# EAGLE design PCB-GONIO-V2 (EAGLE 9.6.2)
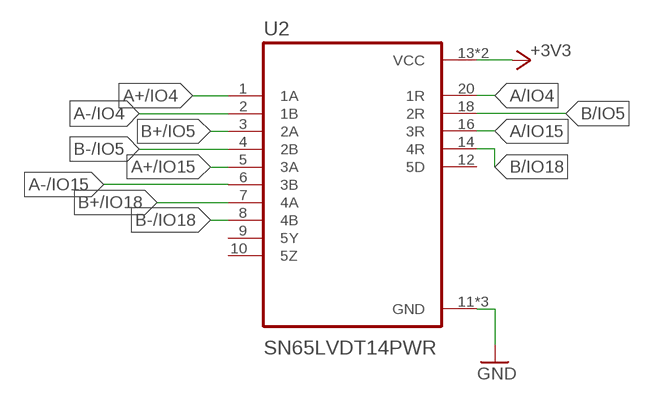
[diagram p0: schematic, sheet 1, part 1 of 2]
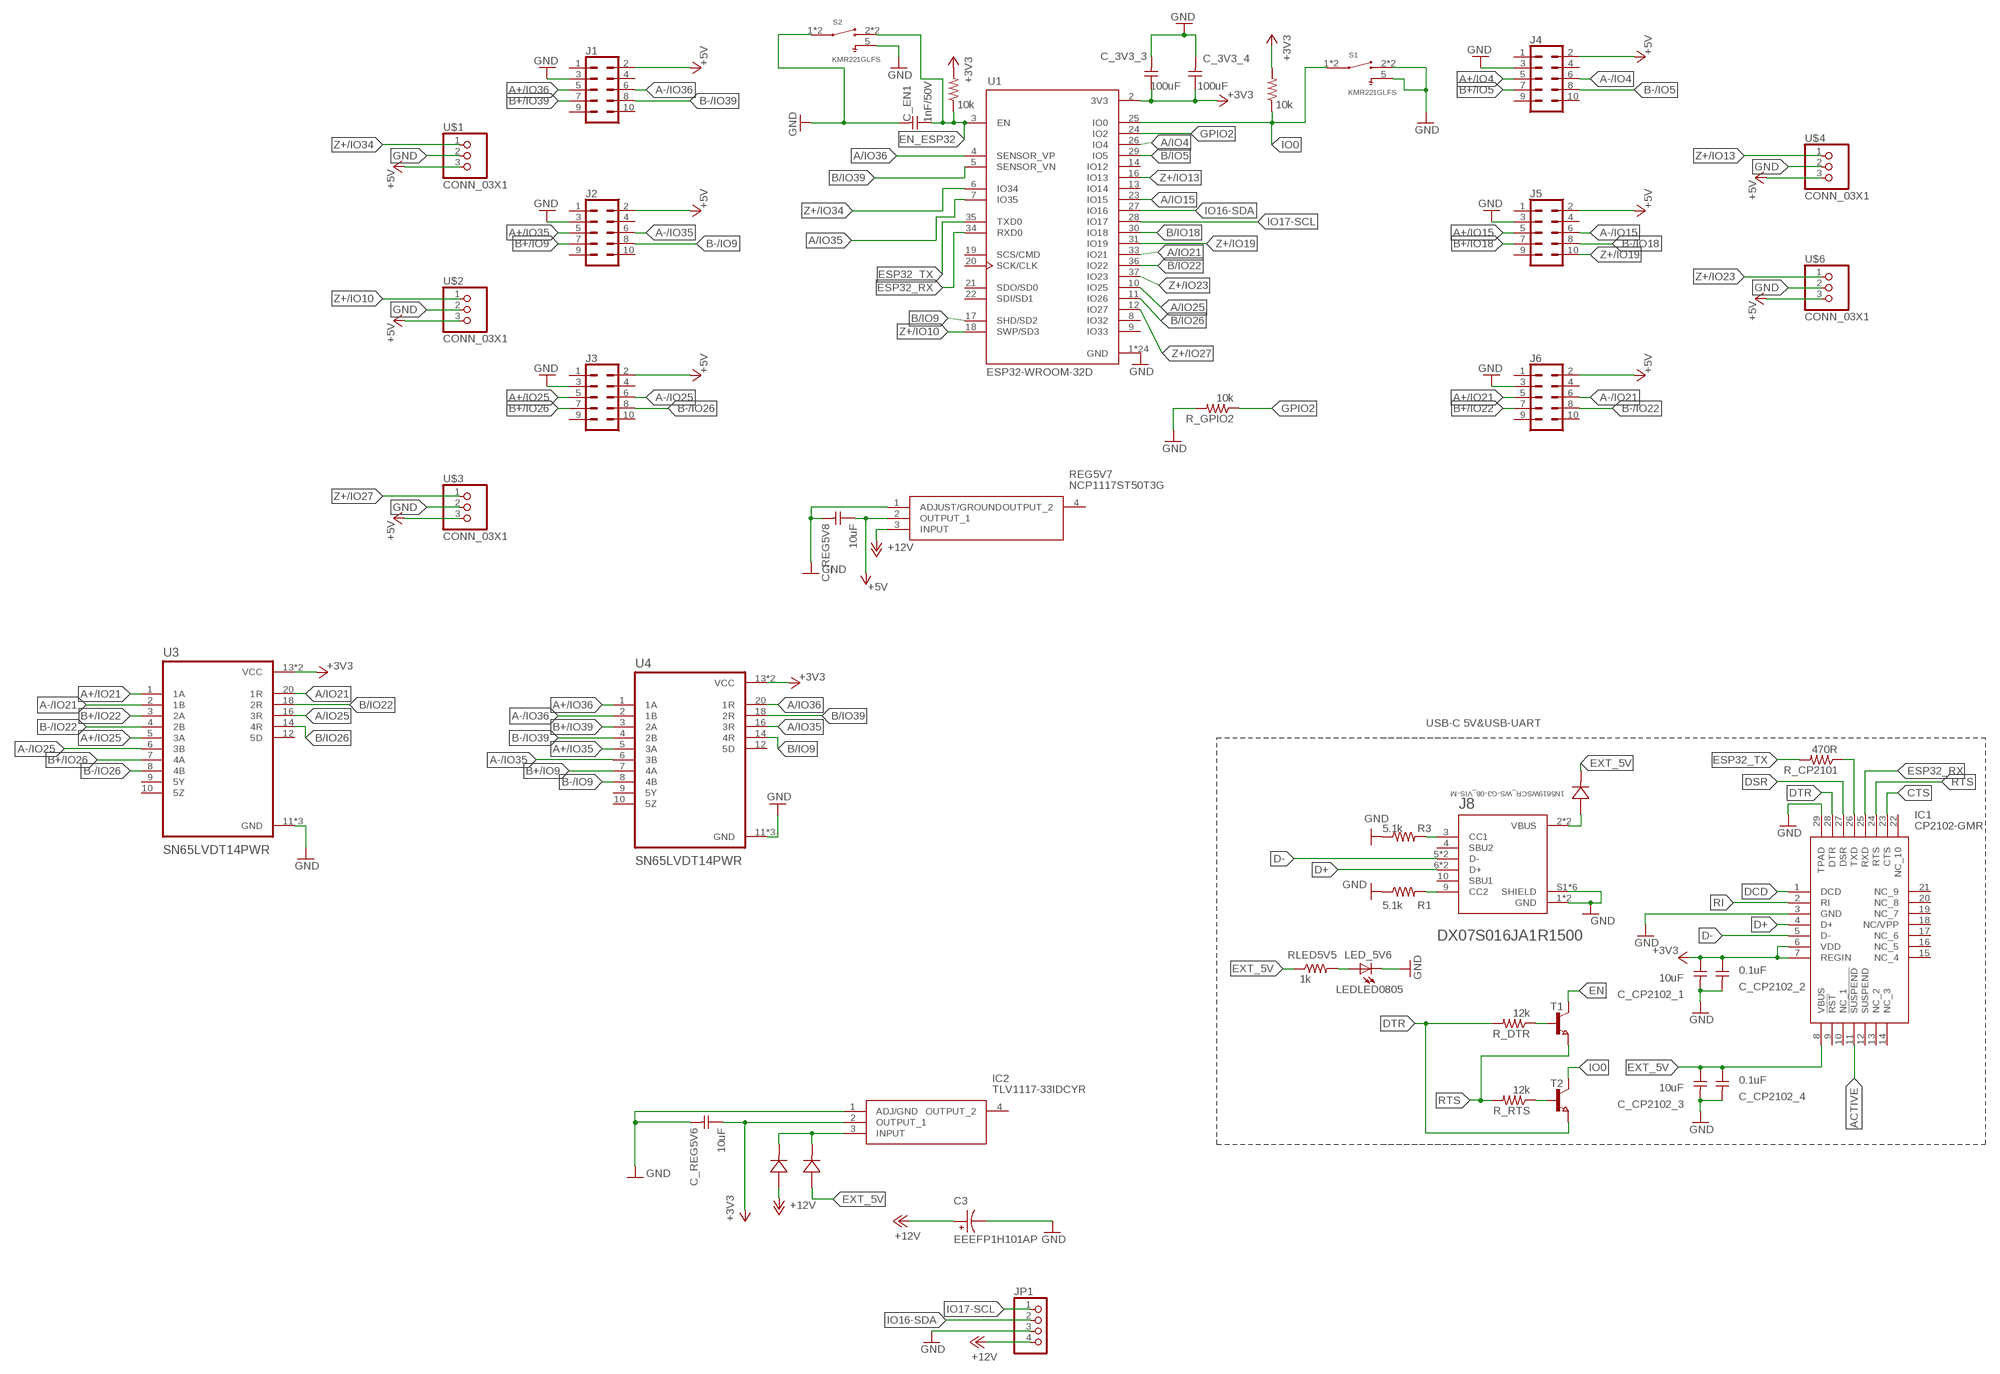
[diagram p1: schematic, sheet 1, part 2 of 2]

## Parts
C3  EEEFP1H101AP  [CAP_EEEFP1H101AP]
C_3V3_3  100uF  CAP_UNPOLARIZEDFAB  [C1206FAB]
C_3V3_4  100uF  CAP_UNPOLARIZEDFAB  [C1206FAB]
C_CP2102_1  10uF  CAP_UNPOLARIZEDFAB  [C1206FAB]
C_CP2102_2  0.1uF  CAP_UNPOLARIZEDFAB  [C1206FAB]
C_CP2102_3  10uF  CAP_UNPOLARIZEDFAB  [C1206FAB]
C_CP2102_4  0.1uF  CAP_UNPOLARIZEDFAB  [C1206FAB]
C_EN1  1nF/50V  CAP_UNPOLARIZEDFAB  [C1206FAB]
C_REG5V6  10uF  CAP_UNPOLARIZEDFAB  [C1206FAB]
C_REG5V8  10uF  CAP_UNPOLARIZEDFAB  [C1206FAB]
CR1  1N5819WSCR_WS-G3-08_VIS-M  [CR_WS-G3-08_VIS-M]
CR2  1N5819WSCR_WS-G3-08_VIS-M  [CR_WS-G3-08_VIS-M]
CR3  1N5819WSCR_WS-G3-08_VIS-M  [CR_WS-G3-08_VIS-M]
IC1  CP2102-GMR  [QFN50P500X500X100-29N]
IC2  TLV1117-33IDCYR  [SOT230P700X180-4N]
J1  CONN_05X2SHD  [2X5-SHROUDED]
J2  CONN_05X2SHD  [2X5-SHROUDED]
J3  CONN_05X2SHD  [2X5-SHROUDED]
J4  CONN_05X2SHD  [2X5-SHROUDED]
J5  CONN_05X2SHD  [2X5-SHROUDED]
J6  CONN_05X2SHD  [2X5-SHROUDED]
J8  DX07S016JA1R1500  [JAE_DX07S016JA1R1500]
JP1  PINHD-1X4  [1X04]
LED_5V6  LEDLED0805  [LEDC2012X90N]
R1  5.1k  R-US_R1206W  [R1206W]
R3  5.1k  R-US_R1206W  [R1206W]
R_CP2101  470R  R1206FAB  [R1206FAB]
R_DTR  12k  R1206FAB  [R1206FAB]
R_GPIO2  10k  R1206FAB  [R1206FAB]
R_PULL_UP1  10k  R1206FAB  [R1206FAB]
R_PULL_UP3  10k  R1206FAB  [R1206FAB]
R_RTS  12k  R1206FAB  [R1206FAB]
REG5V7  NCP1117ST50T3G  [SOT230P700X180-4N]
RLED5V5  1k  R1206FAB  [R1206FAB]
S1  KMR221GLFS  [SW_KMR221GLFS]
S2  KMR221GLFS  [SW_KMR221GLFS]
T1  T_NPN_S8050-J3Y_CHANGJ_SOT23-BEC  [SOT23]
T2  T_NPN_S8050-J3Y_CHANGJ_SOT23-BEC  [SOT23]
U1  ESP32-WROOM-32D  [MODULE_ESP32-WROOM-32D]
U2  SN65LVDT14PWR  [SOP65P640X120-20N]
U3  SN65LVDT14PWR  [SOP65P640X120-20N]
U4  SN65LVDT14PWR  [SOP65P640X120-20N]
U$1  CONN_03X1  [1X3]
U$2  CONN_03X1  [1X3]
U$3  CONN_03X1  [1X3]
U$4  CONN_03X1  [1X3]
U$6  CONN_03X1  [1X3]

## Nets
+3V3: C_3V3_3.1 C_3V3_4.1 C_CP2102_1.1 C_CP2102_2.1 C_REG5V6.1 IC1.6(VDD) IC1.7(REGIN) IC2.2(OUTPUT_1) R_PULL_UP1.2 R_PULL_UP3.2 U1.2(3V3) U2.13(VCC) U2.17(VCC) U3.13(VCC) U3.17(VCC) U4.13(VCC) U4.17(VCC)
+5V: C_REG5V8.1 J1.2 J2.2 J3.2 J4.2 J5.2 J6.2 REG5V7.2(OUTPUT_1) U$1.3 U$2.3 U$3.3 U$4.3 U$6.3
+12V: C3.1 CR2.2 JP1.4 REG5V7.3(INPUT)
A+/IO4: J4.5 U2.1(1A)
A+/IO15: J5.5 U2.5(3A)
A+/IO21: J6.5 U3.1(1A)
A+/IO25: J3.5 U3.5(3A)
A+/IO35: J2.5 U4.5(3A)
A+/IO36: J1.5 U4.1(1A)
A-/IO4: J4.6 U2.2(1B)
A-/IO15: J5.6 U2.6(3B)
A-/IO21: J6.6 U3.2(1B)
A-/IO25: J3.6 U3.6(3B)
A-/IO35: J2.6 U4.6(3B)
A-/IO36: J1.6 U4.2(1B)
A/IO4: U1.26(IO4) U2.20(1R)
A/IO15: U1.23(IO15) U2.16(3R)
A/IO21: U1.33(IO21) U3.20(1R)
A/IO25: U1.10(IO25) U3.16(3R)
A/IO35: U1.7(IO35) U4.16(3R)
A/IO36: U1.4(SENSOR_VP) U4.20(1R)
ACTIVE: IC1.11(!SUSPEND)
B+/IO5: J4.7 U2.3(2A)
B+/IO9: J2.7 U4.7(4A)
B+/IO18: J5.7 U2.7(4A)
B+/IO22: J6.7 U3.3(2A)
B+/IO26: J3.7 U3.7(4A)
B+/IO39: J1.7 U4.3(2A)
B-/IO5: J4.8 U2.4(2B)
B-/IO9: J2.8 U4.8(4B)
B-/IO18: J5.8 U2.8(4B)
B-/IO22: J6.8 U3.4(2B)
B-/IO26: J3.8 U3.8(4B)
B-/IO39: J1.8 U4.4(2B)
B/IO5: U1.29(IO5) U2.18(2R)
B/IO9: U1.17(SHD/SD2) U4.14(4R)
B/IO18: U1.30(IO18) U2.14(4R)
B/IO22: U1.36(IO22) U3.18(2R)
B/IO26: U1.11(IO26) U3.14(4R)
B/IO39: U1.5(SENSOR_VN) U4.18(2R)
CTS: IC1.23(CTS)
D+: IC1.4(D+) J8.6(D+) J8.7(D+)
D-: IC1.5(D-) J8.5(D-) J8.8(D-)
DCD: IC1.1(DCD)
DSR: IC1.27(DSR)
DTR: IC1.28(DTR) R_DTR.2 T2.2(E)
EN: T1.3(C)
EN_ESP32: C_EN1.1 R_PULL_UP1.1 S2.2 S2.3 U1.3(EN)
ESP32_RX: IC1.25(RXD) U1.34(RXD0)
ESP32_TX: R_CP2101.2 U1.35(TXD0)
EXT_5V: C_CP2102_3.1 C_CP2102_4.1 CR1.1 CR3.2 IC1.8(VBUS) RLED5V5.1
GND: C3.2 C_3V3_3.2 C_3V3_4.2 C_CP2102_1.2 C_CP2102_2.2 C_CP2102_3.2 C_CP2102_4.2 C_EN1.2 C_REG5V6.2 C_REG5V8.2 IC1.3(GND) IC1.29(TPAD) IC2.1(ADJ/GND) J1.3 J2.3 J3.3 J4.3 J5.3 J6.3 J8.1(GND) J8.12(GND) J8.S1(SHIELD) J8.S2(SHIELD) J8.S3(SHIELD) J8.S4(SHIELD) J8.S5(SHIELD) J8.S6(SHIELD) JP1.3 LED_5V6.1(C) R1.1 R3.1 R_GPIO2.2 REG5V7.1(ADJUST/GROUND) S1.2 S1.3 S1.5 S2.1 S2.4 S2.5 U1.1(GND) U1.15(GND) U1.38(GND) U1.39_1(GND) U1.39_2(GND) U1.39_3(GND) U1.39_4(GND) U1.39_5(GND) U1.39_6(GND) U1.39_7(GND) U1.39_8(GND) U1.39_9(GND) U1.39_10(GND) U1.39_11(GND) U1.39_12(GND) U1.39_13(GND) U1.39_14(GND) U1.39_15(GND) U1.39_16(GND) U1.39_17(GND) U1.39_18(GND) U1.39_19(GND) U1.39_20(GND) U1.39_21(GND) U2.11(GND) U2.15(GND) U2.19(GND) U3.11(GND) U3.15(GND) U3.19(GND) U4.11(GND) U4.15(GND) U4.19(GND) U$1.2 U$2.2 U$3.2 U$4.2 U$6.2
GND1: J8.9(CC2) R1.2
GND3: J8.3(CC1) R3.2
GPIO2: R_GPIO2.1 U1.24(IO2)
IO0: R_PULL_UP3.1 S1.1 S1.4 T2.3(C) U1.25(IO0)
IO16-SDA: JP1.2 U1.27(IO16)
IO17-SCL: JP1.1 U1.28(IO17)
N$3: CR1.2 J8.2(VBUS) J8.11(VBUS)
N$4: CR2.1 CR3.1 IC2.3(INPUT)
N$8: IC1.26(TXD) R_CP2101.1
N$9: R_DTR.1 T1.1(B)
N$10: R_RTS.1 T2.1(B)
N$19: LED_5V6.2(A) RLED5V5.2
RI: IC1.2(RI)
RTS: IC1.24(RTS) R_RTS.2 T1.2(E)
Z+/IO10: U1.18(SWP/SD3) U$2.1
Z+/IO13: U1.16(IO13) U$4.1
Z+/IO19: J5.10 U1.31(IO19)
Z+/IO23: U1.37(IO23) U$6.1
Z+/IO27: U1.12(IO27) U$3.1
Z+/IO34: U1.6(IO34) U$1.1
Unconnected: IC1.9(!RST) IC1.10(NC_1) IC1.12(SUSPEND) IC1.13(NC_2) IC1.14(NC_3) IC1.15(NC_4) IC1.16(NC_5) IC1.17(NC_6) IC1.18(NC/VPP) IC1.19(NC_7) IC1.20(NC_8) IC1.21(NC_9) IC1.22(NC_10) IC2.4(OUTPUT_2) J1.1 J1.4 J1.9 J1.10 J2.1 J2.4 J2.9 J2.10 J3.1 J3.4 J3.9 J3.10 J4.1 J4.4 J4.9 J4.10 J5.1 J5.4 J5.9 J6.1 J6.4 J6.9 J6.10 J8.4(SBU2) J8.10(SBU1) REG5V7.4(OUTPUT_2) U1.8(IO32) U1.9(IO33) U1.13(IO14) U1.14(IO12) U1.19(SCS/CMD) U1.20(SCK/CLK) U1.21(SDO/SD0) U1.22(SDI/SD1) U2.9(5Y) U2.10(5Z) U2.12(5D) U3.9(5Y) U3.10(5Z) U3.12(5D) U4.9(5Y) U4.10(5Z) U4.12(5D)

## Notes on the sheet
- USB-C 5V&USB-UART

## Library data of the parts
C3 = EEEFP1H101AP:EEEFP1H101AP; CHECK_PRICES: https://www.snapeda.com/parts/EEEFP1H101AP/Panasonic/view-part/?ref=eda; DESCRIPTION: 100µF 50V Aluminum Electrolytic Capacitors Radial, Can - SMD 180mOhm @ 100kHz 2000 Hrs @ 105°C; DIGIKEY_PART_NUMBER: P19726TR-ND; MF: Panasonic; MP: EEEFP1H101AP; PACKAGE: RADIAL-2 Panasonic; SNAPEDA_LINK: https://www.snapeda.com/parts/EEEFP1H101AP/Panasonic/view-part/?ref=snap
C_3V3_3 C_3V3_4 C_CP2102_1-C_CP2102_4 C_EN1 C_REG5V6 C_REG5V8 = fab:CAP_UNPOLARIZED
CR1-CR3 = 1N4148WS:1N5819WS; COPYRIGHT: Copyright (C) 2022 Ultra Librarian. All rights reserved.; DIGI-KEY_PART_NUMBER_1: 1N4148WS-G3-08GITR-ND; DIGI-KEY_PART_NUMBER_2: 1N4148WS-G3-08GICT-ND; DIGI-KEY_PART_NUMBER_3: 1N4148WS-G3-08GIDKR-ND; MANUFACTURER_PART_NUMBER: 1N4148WS-G3-08; MFR_NAME: Vishay
IC1 = SamacSys_Parts:CP2102-GMR: I/O Controller Interface IC USB-TO-UART BRIDGE, qfn-28 Source: Datasheet <https://www.silabs.com/Support Documents/TechnicalDocs/CP2102-9.pdf>; DESCRIPTION: I/O Controller Interface IC USB-TO-UART BRIDGE, qfn-28; HEIGHT: 1mm; MANUFACTURER_NAME: Silicon Labs; MANUFACTURER_PART_NUMBER: CP2102-GMR; MOUSER_PART_NUMBER: 634-CP2102-GMR; MOUSER_PRICE-STOCK: https://www.mouser.co.uk/ProductDetail/Silicon-Labs/CP2102-GMR?qs=cNyzPCcHMUWu%2FiPhR8KQAw%3D%3D
IC2 = TLV1117-33IDCYR:TLV1117-33IDCYR: Single Output LDO, 800mA, Fixed and Adj., Internal Current limit, Thermal Overload Protection Source: Datasheet <https://datasheet.datasheetarchive.com/originals/distributors/Datasheets-DGA25/1767134.pdf>; DESCRIPTION: Single Output LDO, 800mA, Fixed and Adj., Internal Current limit, Thermal Overload Protection; HEIGHT: 1.8mm; MANUFACTURER_NAME: Texas Instruments; MANUFACTURER_PART_NUMBER: TLV1117-33IDCYR; MOUSER_PART_NUMBER: 595-TLV1117-33IDCYR; MOUSER_PRICE-STOCK: https://www.mouser.co.uk/ProductDetail/Texas-Instruments/TLV1117-33IDCYR?qs=p6lVfQR1GSoKgp3tAXcW5w%3D%3D
J1-J6 = fab:CONN_05X2: Multi connection point. Often used as Generic Header-pin footprint for 0.1 inch spaced/style header connections For AVR SPI programming port, see special device with nice symbol: "AVR_SPI_PROG_5x2.dev" You can populate with any combo of single row headers, but if you'd like an exact match, check these: 2x5 AVR ICSP Male Header <https://www.sparkfun.com/products/778> (PRT-00778) 2x5 Pin Shrouded Header <https://www.sparkfun.com/products/8506> (PRT-08506) On any of the 0.1 inch spaced packages, you can populate with these: Break Away Headers - Straight <https://www.sparkfun.com/products/116> (PRT-00116) Break Away Male Headers - Right Angle <https://www.sparkfun.com/products/553> (PRT-00553) Female Headers <https://www.sparkfun.com/products/115> (PRT-00115) Break Away Headers - Machine Pin <https://www.sparkfun.com/products/117> (PRT-00117) Break Away Female Headers - Swiss Machine Pin <https://www.sparkfun.com/products/743> (PRT-00743) Special note: the shrouded connector mates well with our 5x2 ribbon cables: 2x5 Pin IDC Ribbon Cable <https://www.sparkfun.com/products/8535> (PRT-08535); PROD_ID: CONN-08671; SF_ID: PRT-08506
J8 = DX07S016JA1R1500 (2):DX07S016JA1R1500: Check availability <https://pricing.snapeda.com/parts/DX07S016JA1R1500/Japan%20Aviation%20Electronics/view-part?ref=eda>; AVAILABILITY: In Stock; CHECK_PRICES: https://www.snapeda.com/parts/DX07S016JA1R1500/JAE+Electronics/view-part/?ref=eda; DESCRIPTION: USB-C (USB TYPE-C) USB 2.0 Receptacle Connector 24 (16+8 Dummy) Position Surface Mount, Right Angle; Through Hole; MF: Japan Aviation Electronics; MP: DX07S016JA1R1500; PACKAGE: None; PRICE: None; SNAPEDA_LINK: https://www.snapeda.com/parts/DX07S016JA1R1500/JAE+Electronics/view-part/?ref=snap
JP1 = pinhead:PINHD-1X4: PIN HEADER
LED_5V6 = fab:LED: LED
R1 R3 = rcl:R-US_: RESISTOR, American symbol; SPICEPREFIX: R
R_CP2101 R_DTR R_GPIO2 R_PULL_UP1 R_PULL_UP3 R_RTS RLED5V5 = fab:R: Resistor (US Symbol) Variants with postfix FAB are widened to allow the routing of internal traces
REG5V7 = SamacSys_Parts:NCP1117ST50T3G: ON SEMICONDUCTOR - NCP1117ST50T3G - LDO, REG, 20VIN, 1A, 5V, 1%, SOT223-3 Source: Datasheet <http://uk.rs-online.com/web/p/products/8022130P>; ALLIED_NUMBER: 70466898; DESCRIPTION: ON SEMICONDUCTOR - NCP1117ST50T3G - LDO, REG, 20VIN, 1A, 5V, 1%, SOT223-3; HEIGHT: 1.8mm; LCSC_PART: C17314; MANUFACTURER_NAME: ON Semiconductor; MANUFACTURER_PART_NUMBER: NCP1117ST50T3G; RS_PART_NUMBER: 8022130P; RS_PRICE-STOCK: http://uk.rs-online.com/web/p/products/8022130P
S1 S2 = KMR221GLFS:KMR221GLFS: Check availability <https://pricing.snapeda.com/parts/KMR221GLFS/C%26K/view-part?ref=eda>; AVAILABILITY: In Stock; CHECK_PRICES: https://www.snapeda.com/parts/KMR221GLFS/C%2526K/view-part/?ref=eda; DESCRIPTION: Tactile Switch SPST-NO Top Actuated Surface Mount; MF: C&K; MP: KMR221GLFS; PACKAGE: None; PRICE: None; SNAPEDA_LINK: https://www.snapeda.com/parts/KMR221GLFS/C%2526K/view-part/?ref=snap
T1 T2 = JLC PCB Basic Parts_loc:T_NPN_: Transistor NPN; LCSC_DATASHEET: https://datasheet.lcsc.com/lcsc/1810161230_Changjiang-Electronics-Tech--CJ-S8050-J3Y_C2146.pdf; LCSC_PART: C2146; LCSC_ROTATION_CCW: 180; LCSC_STOCK: 382366; PROPERTIES: 25V 300mW 500mA 200@50mA,1V 150MHz 600mV@500mA,50mA NPN +150°C@(Tj) SOT-23(SOT-23-3) Bipolar Transistors - BJT ROHS
U1 = ESP32-WROOM-32D:ESP32-WROOM-32D: Check availability <https://pricing.snapeda.com/parts/ESP32-WROOM-32D/Espressif%20Systems/view-part?ref=eda>; AVAILABILITY: In Stock; CHECK_PRICES: https://www.snapeda.com/parts/ESP32-WROOM-32D/Espressif+Systems/view-part/?ref=eda; DESCRIPTION: Multiprotocol Modules SMD Module, ESP32-D0WD, 32Mbits SPI flash, UART mode, PCB antenna; MF: Espressif Systems; MP: ESP32-WROOM-32D; PACKAGE: Non Standard Espressif Systems; PRICE: None; SNAPEDA_LINK: https://www.snapeda.com/parts/ESP32-WROOM-32D/Espressif+Systems/view-part/?ref=snap
U2-U4 = SN65LVDT14PWR:SN65LVDT14PWR: Check availability <https://pricing.snapeda.com/parts/SN65LVDT14PWR/Texas%20Instruments/view-part?ref=eda>; AVAILABILITY: In Stock; CHECK_PRICES: https://www.snapeda.com/parts/SN65LVDT14PWR/Texas+Instruments/view-part/?ref=eda; DESCRIPTION: Multi-channel transceivers for SPI over LVDS; MF: Texas Instruments; MP: SN65LVDT14PWR; PACKAGE: TSSOP-20 Texas Instruments; PRICE: None; SNAPEDA_LINK: https://www.snapeda.com/parts/SN65LVDT14PWR/Texas+Instruments/view-part/?ref=snap
U$1-U$4 U$6 = fab:CONN_03X1

## Board
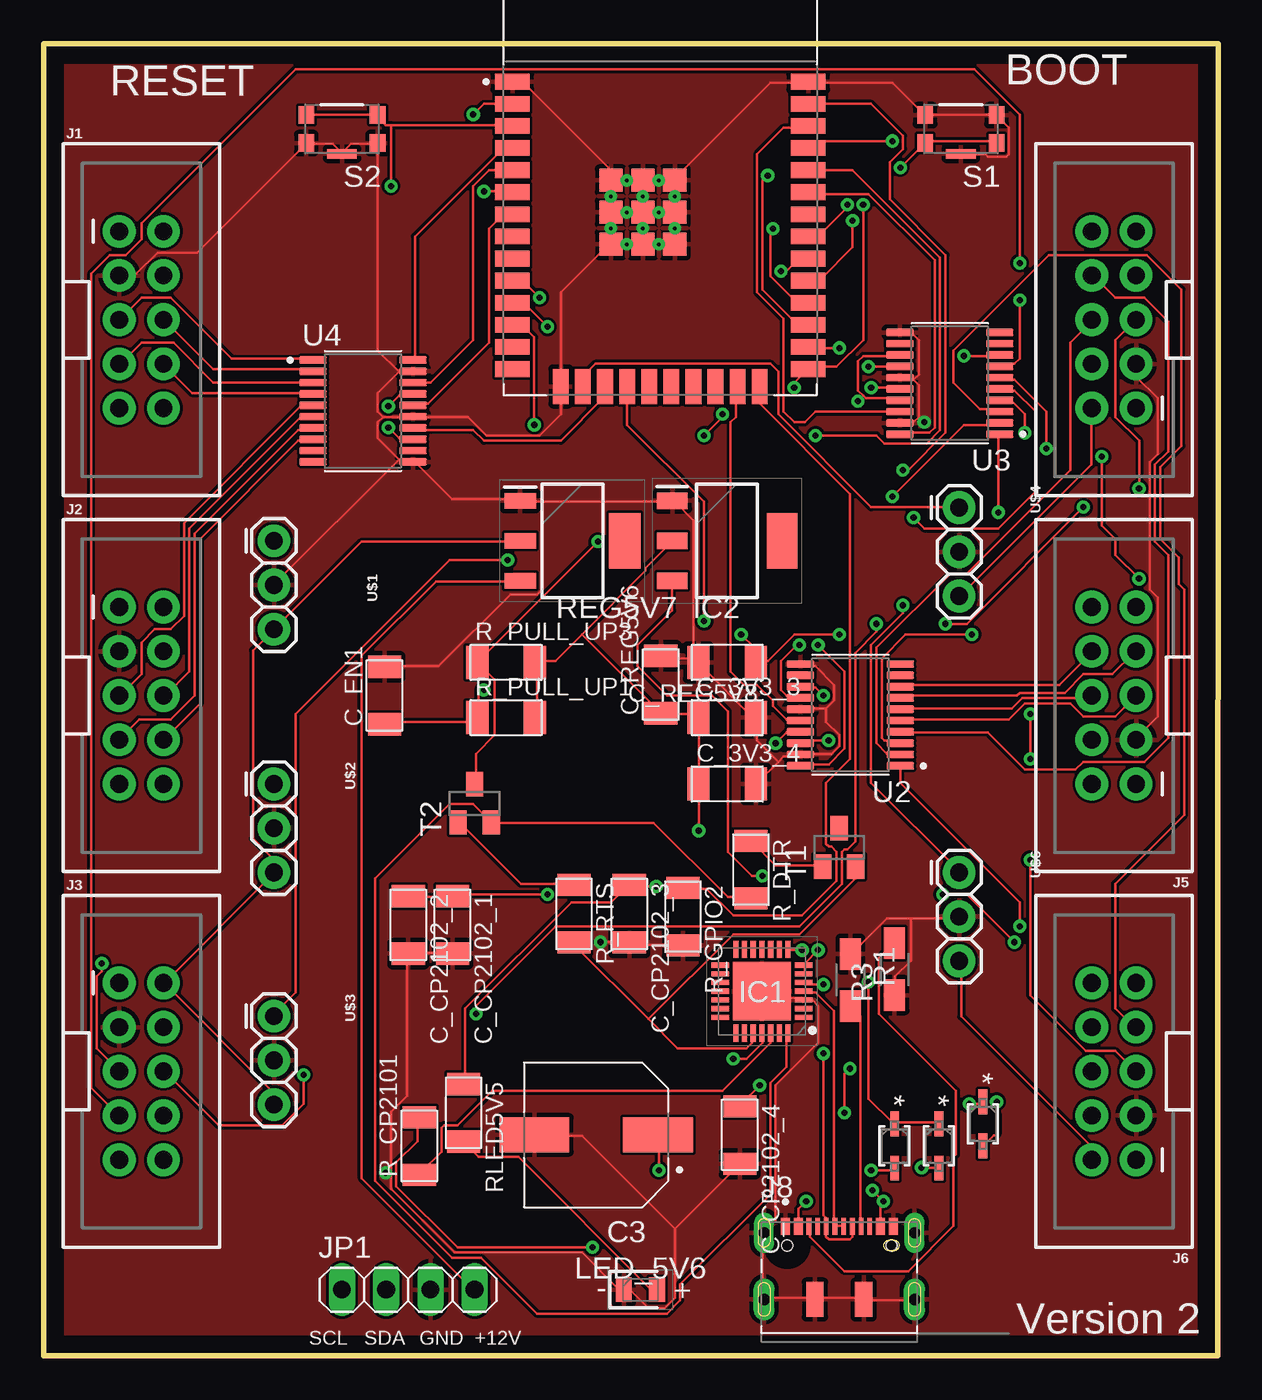
[diagram p2: board, top side]
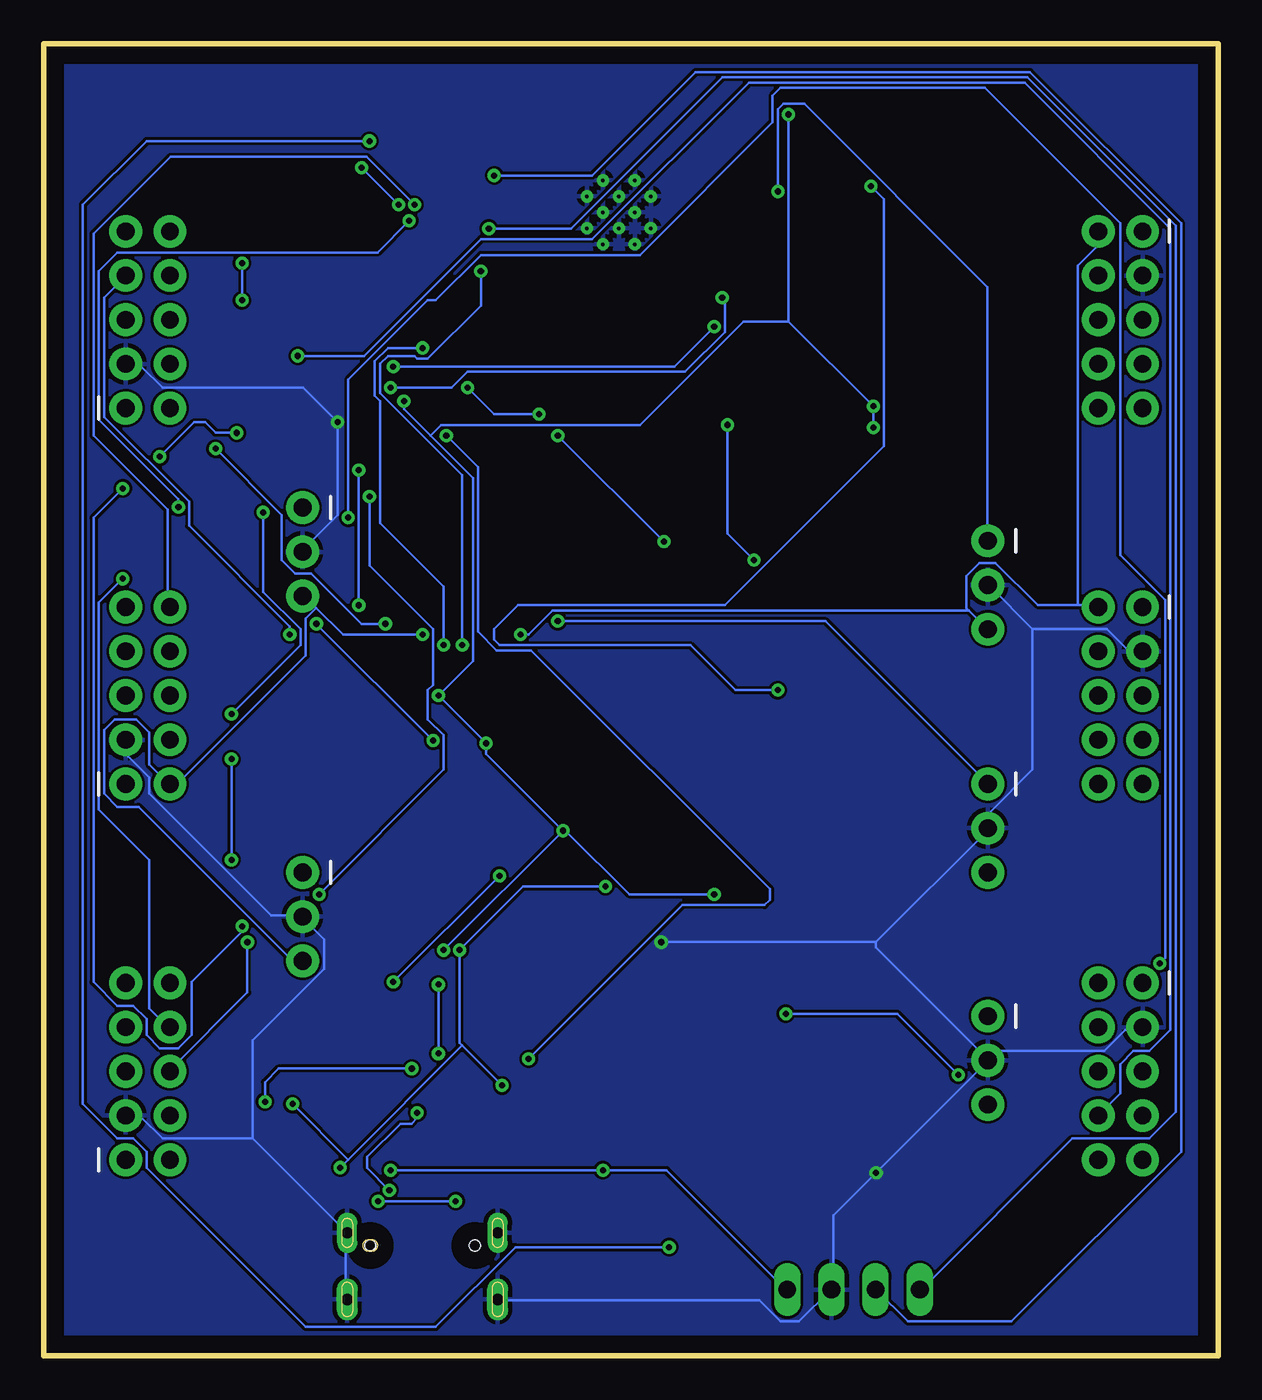
[diagram p3: board, bottom side, seen from below]

Size 67.49 x 75.4 mm. Coordinates in mm from the lower left corner, seen from the top.
Outline: 0,0 67.47,0 67.49,75.4 0,75.4 0,0
Copper layers (1*16): Top 0.035mm / dielectric 1.5mm / Bottom 0.035mm
Design rules "default": minimum track width 6mil, minimum drill 0.35mm, track to track 6mil, track to pad 6mil, pad to pad 6mil, via to via 6mil, smd to smd 6mil, copper to edge 40mil, drill to drill 6mil, minimum pad ring 10mil, minimum via ring 8mil, stop-mask expansion 4mil, vias tented up to drill 0mil, thermal gap 10mil

### Footprints (pad centres in the part's own frame; a part is rotated, then mirrored left to right if it is on the bottom)
CAP_EEEFP1H101AP = smd 4 x 2: 1 -3.55,0; 2 3.55,0
C1206FAB = smd 1.27 x 1.905: 1 -1.651,0; 2 1.651,0
CR_WS-G3-08_VIS-M = smd 1.422 x 0.508: 1 -1.27,0; 2 1.27,0
QFN50P500X500X100-29N = smd 1 x 0.3: 1 -2.4,1.5; 2 -2.4,1; 3 -2.4,0.5; 4 -2.4,0; 5 -2.4,-0.5; 6 -2.4,-1; 7 -2.4,-1.5; 15 2.4,-1.5; 16 2.4,-1; 17 2.4,-0.5; 18 2.4,0; 19 2.4,0.5; 20 2.4,1; 21 2.4,1.5 | smd 0.3 x 1: 8 -1.5,-2.4; 9 -1,-2.4; 10 -0.5,-2.4; 11 0,-2.4; 12 0.5,-2.4; 13 1,-2.4; 14 1.5,-2.4; 22 1.5,2.4; 23 1,2.4; 24 0.5,2.4; 25 0,2.4; 26 -0.5,2.4; 27 -1,2.4; 28 -1.5,2.4 | smd 3.35 x 3.35: 29 0,0
SOT230P700X180-4N = smd 1.75 x 0.95: 1 -3.15,2.3; 2 -3.15,0; 3 -3.15,-2.3 | smd 1.75 x 3.2: 4 3.15,0
2X5-SHROUDED = drill 1.016 pad 1.88: 1 -1.27,5.08; 2 1.27,5.08; 3 -1.27,2.54; 4 1.27,2.54; 5 -1.27,0; 6 1.27,0; 7 -1.27,-2.54; 8 1.27,-2.54; 9 -1.27,-5.08; 10 1.27,-5.08
JAE_DX07S016JA1R1500 = smd 0.52 x 1: 1 -3.1,1.1; 2 -2.35,1.1; 11 2.35,1.1; 12 3.1,1.1 | smd 0.27 x 1: 3 -1.75,1.1; 4 -1.25,1.1; 5 -0.75,1.1; 6 -0.25,1.1; 7 0.25,1.1; 8 0.75,1.1; 9 1.25,1.1; 10 1.75,1.1 | smd 1 x 2: S1 -1.4,-3.1; S2 1.4,-3.1 | drill 0.65 long: S3 -4.32,0.725; S4 4.32,0.725 | drill 0.65 pad 1.2 long: S5 -4.32,-3.1; S6 4.32,-3.1 | hole 0.6: 3,0 | hole 0.63: 3,0; -3,0
1X04 = drill 1.016 long: 1 -3.81,0; 2 -1.27,0; 3 1.27,0; 4 3.81,0
LEDC2012X90N = smd 0.9 x 1.4: 1 -0.95,0; 2 0.95,0
R1206W = smd 1.8 x 1.2: 1 -1.499,0; 2 1.499,0
R1206FAB = smd 1.27 x 1.905: 1 -1.651,0; 2 1.651,0
SOT230P700X180-4N' = smd 1.8 x 0.9: 1 -3,2.3; 2 -3,0; 3 -3,-2.3 | smd 1.8 x 3.2: 4 3,0
SW_KMR221GLFS = smd 0.9 x 1: 1 -2.05,0.8; 2 -2.05,-0.8; 3 2.05,-0.8; 4 2.05,0.8 | smd 1.7 x 0.55: 5 0,1.425
SOT23 = smd 1.4 x 1: 1 -1.1,0.95; 2 -1.1,-0.95; 3 1.1,0
MODULE_ESP32-WROOM-32D = smd 2 x 0.9: 1 -8.5,5.26; 2 -8.5,3.99; 3 -8.5,2.72; 4 -8.5,1.45; 5 -8.5,0.18; 6 -8.5,-1.09; 7 -8.5,-2.36; 8 -8.5,-3.63; 9 -8.5,-4.9; 10 -8.5,-6.17; 11 -8.5,-7.44; 12 -8.5,-8.71; 13 -8.5,-9.98; 14 -8.5,-11.25; 25 8.5,-11.25; 26 8.5,-9.98; 27 8.5,-8.71; 28 8.5,-7.44; 29 8.5,-6.17; 30 8.5,-4.9; 31 8.5,-3.63; 32 8.5,-2.36; 33 8.5,-1.09; 34 8.5,0.18; 35 8.5,1.45; 36 8.5,2.72; 37 8.5,3.99; 38 8.5,5.26 | smd 0.9 x 2: 15 -5.715,-12.25; 16 -4.445,-12.25; 17 -3.175,-12.25; 18 -1.905,-12.25; 19 -0.635,-12.25; 20 0.635,-12.25; 21 1.905,-12.25; 22 3.175,-12.25; 23 4.445,-12.25; 24 5.715,-12.25 | smd 1.33 x 1.33: 39_1 -2.835,-0.405; 39_2 -1,-0.405; 39_3 0.835,-0.405; 39_4 -2.835,-2.24; 39_5 -1,-2.24; 39_6 0.835,-2.24; 39_7 -2.835,-4.075; 39_8 -1,-4.075; 39_9 0.835,-4.075 | drill 0.2 pad 0.3: 39_10 -1.917,-0.405; 39_11 -0.083,-0.405; 39_12 -2.835,-1.323; 39_13 -1,-1.323; 39_14 0.835,-1.323; 39_15 -1.917,-2.24; 39_16 -0.083,-2.24; 39_17 -2.835,-3.158; 39_18 -1,-3.158; 39_19 0.835,-3.158; 39_20 -1.917,-4.075; 39_21 -0.083,-4.075
SOP65P640X120-20N = smd 1.57 x 0.41: 1 -2.87,2.925; 2 -2.87,2.275; 3 -2.87,1.625; 4 -2.87,0.975; 5 -2.87,0.325; 6 -2.87,-0.325; 7 -2.87,-0.975; 8 -2.87,-1.625; 9 -2.87,-2.275; 10 -2.87,-2.925; 11 2.87,-2.925; 12 2.87,-2.275; 13 2.87,-1.625; 14 2.87,-0.975; 15 2.87,-0.325; 16 2.87,0.325; 17 2.87,0.975; 18 2.87,1.625; 19 2.87,2.275; 20 2.87,2.925
1X3 = drill 1.016 pad 1.88: 1 0,0; 2 2.54,0; 3 5.08,0

### Placement (x,y rotation side)
C3  31.75,12.7 180 top
C_3V3_3  39.27,36.67 0 top
C_3V3_4  39.27,32.86 0 top
C_CP2102_1  23.5,24.77 270 top
C_CP2102_2  20.95,24.77 270 top
C_CP2102_3  33.66,25.4 270 top
C_CP2102_4  40.01,12.7 270 top
C_EN1  19.59,37.94 90 top
C_REG5V6  35.46,38.58 90 top
C_REG5V8  39.27,39.85 180 top
CR1  53.98,13.34 270 top
CR2  48.9,12.06 270 top
CR3  51.44,12.06 270 top
IC1  41.27,20.95 180 top
IC2  39.27,46.83 0 top
J1  5.62,59.53 0 top
J2  5.62,37.94 0 top
J3  5.62,16.35 0 top
J4  61.5,59.53 180 top
J5  61.5,37.94 180 top
J6  61.5,16.35 180 top
J8  45.72,6.35 0 top
JP1  20.95,3.81 0 top
LED_5V6  34.29,3.81 0 top
R1  46.35,21.59 270 top
R3  48.9,22.23 90 top
R_CP2101  21.59,12.06 90 top
R_DTR  40.64,27.94 270 top
R_GPIO2  36.73,25.24 270 top
R_PULL_UP1  26.57,36.67 0 top
R_PULL_UP3  26.57,39.85 0 top
R_RTS  30.48,25.4 270 top
REG5V7  NCP1117ST50T3G  [SOT230P700X180-4N']  30.38,46.83 0 top
RLED5V5  24.13,13.97 270 top
S1  52.7,70.48 180 top
S2  17.14,70.48 180 top
T1  45.72,29.21 90 top
T2  24.77,31.75 90 top
U1  35.43,67.94 0 top
U2  46.35,36.83 180 top
U3  52.07,55.88 180 top
U4  18.35,54.29 0 top
U$1  13.24,46.83 270 top
U$2  13.24,32.86 270 top
U$3  13.24,19.53 270 top
U$4  52.61,48.74 270 top
U$6  52.61,27.78 270 top

### Tracks (layer width: path | path; a pad name or v marks a point on that pad's centre or on a via)
+3V3  (via drill 0.35)
  Top 0.152: v19.81,53.34 20.42,52.73 21.18,52.73 U4.13 | v19.81,54.56 20.42,55.17 21.18,55.17 U4.17 | v24.69,71.32 25.3,71.93 26.82,71.93 U1.2 | 30.94,41.45 29.41,39.93 28.35,39.93 R_PULL_UP3.2 28.35,39.78 28.35,36.73 R_PULL_UP1.2 | 30.94,41.45 34.59,45.11 34.59,45.26 36.12,46.79 IC2.2 | 47.09,55.17 46.79,55.47 46.79,57.15 47.09,57.45 49.07,57.45 U3.13 | 47.09,55.17 47.24,55.02 49.07,55.02 U3.17 | C_CP2102_2.1 21.03,26.36 23.47,26.36 C_CP2102_1.1 23.62,26.52 v28.96,26.52 | IC1.6 43.74,22.1 43.74,22.4 IC1.7 43.74,22.55 v44.5,23.32 | v37.64,30.18 37.64,32.77 C_3V3_4.1 37.64,32.92 37.64,36.58 C_3V3_3.1 37.49,36.73 37.34,36.88 35.51,36.88 C_REG5V6.1 30.94,41.45 | v42.06,35.2 42.67,35.81 43.43,35.81 U2.17 | v44.81,37.95 44.35,38.41 43.59,38.41 U2.13 | v46.79,54.86 47.09,55.17
  Bottom 0.152: v19.81,53.34 v19.81,54.56 24.69,59.44 | 24.69,59.44 v24.69,71.32 | v37.64,30.18 v44.5,23.32 | v37.64,30.18 42.06,34.59 v42.06,35.2 v44.81,37.95 42.82,39.93 42.82,50.44 45.26,52.88 | v28.96,26.52 33.83,26.52 37.49,30.18 v37.64,30.18 | v46.79,54.86 46.79,54.41 45.26,52.88 | 24.69,59.44 27.28,59.44 33.22,53.49 44.65,53.49 45.26,52.88
+5V  (via drill 0.35)
  Top 0.152: J6.2 60.2,11.28 60.2,12.04 52.73,19.51 52.73,22.55 U$6.3 | v45.72,41.45 43.13,41.45 41.6,39.93 41,39.93 C_REG5V8.1 40.84,39.93 40.84,40.69 v40.08,41.45 | J4.2 60.2,54.41 60.2,51.21 52.73,43.74 U$4.3 | U$3.3 13.11,14.48 13.11,15.24 7.01,21.34 J3.2 7.01,21.49 13.26,27.74 U$2.3 13.11,27.89 13.11,28.65 12.04,29.72 12.04,40.54 13.11,41.6 U$1.3 13.26,41.76 18.29,46.79 27.28,46.79 REG5V7.2
  Bottom 0.152: v45.72,41.45 50.29,41.45 51.82,42.98 | 51.82,42.98 52.58,43.74 U$4.3 | 51.82,42.98 52.43,42.37 52.43,40.23 59.74,32.92 60.2,32.92 J5.2 60.35,32.92 61.42,33.98 61.42,35.81 62.18,36.58 63.4,36.58 64.01,35.97 64.01,32.31 63.25,31.55 62.03,31.55 53.19,22.71 52.73,22.71 U$6.3 | 8.08,43.13 10.36,43.13 12.8,45.57 13.72,45.57 14.48,44.81 14.48,42.98 14.33,42.82 | 8.08,43.13 7.01,43.13 J2.2 | 14.33,42.82 13.26,41.76 U$1.3 | 8.08,43.13 8.08,62.64 7.01,63.7 7.01,64.47 J1.2 | v40.08,41.45 39.62,41.45 38.25,42.82 14.33,42.82
+12V  (via drill 0.35)
  Top 0.152: v47.55,10.67 48.77,10.67 CR2.2 | REG5V7.3 27.28,44.5 22.55,44.5 18.29,40.23 18.29,10.21 24.69,3.81 JP1.4 | v35.36,10.67 35.36,12.65 C3.1
  Bottom 0.152: v47.55,10.67 v35.36,10.67 31.7,10.67 24.84,3.81 JP1.4
A+/IO4  (via drill 0.35)
  Top 0.152: v56.08,24.69 56.08,26.06 49.23,32.92 49.23,33.83 U2.1 | v62.94,49.84 62.94,52.58 61.57,53.95 61.57,58.37 62.64,59.44 J4.5
  Bottom 0.152: v56.08,24.69 56.08,24.38 58.98,21.49 58.98,18.44 59.74,17.68 60.81,17.68 61.57,18.44 61.57,19.36 62.33,20.12 63.25,20.12 64.62,21.49 64.62,48.16 v62.94,49.84
A+/IO15
  Top 0.152: U2.5 49.23,36.58 55.47,36.58 56.39,37.49 58.98,37.49 59.74,36.73 61.57,36.73 62.64,37.8 J5.5
A+/IO21  (via drill 0.35)
  Top 0.152: v54.86,48.46 54.86,52.88 U3.1 | v56.69,34.29 v56.69,36.88 | v56.69,28.5 56.69,20.73 59.89,17.53 61.57,17.53 62.64,16.46 J6.5
  Bottom 0.152: v54.86,48.46 54.86,43.89 52.73,41.76 52.73,40.84 v56.69,36.88 | v56.69,28.5 v56.69,34.29
A+/IO25  (via drill 0.35)
  Top 0.152: v49.99,48.16 50.6,47.55 54.86,47.55 57,49.68 57,54.25 55.78,55.47 55.02,55.47 U3.5 | v3.35,22.55 3.35,22.1 3.05,21.79 3.05,17.68 4.27,16.46 J3.5
  Bottom 0.152: v49.99,48.16 49.99,56.08 45.41,60.66 44.96,60.66 42.37,63.25 33.22,63.25 25.6,70.87 25.6,72.39 25.15,72.85 13.41,72.85 5.64,65.08 5.64,46.02 3.05,43.43 3.05,22.86 v3.35,22.55
A+/IO35
  Top 0.152: U4.5 15.39,54.56 14.78,54.56 8.08,47.85 8.08,42.52 7.32,41.76 6.4,41.76 5.64,41 5.64,39.17 4.42,37.95 J2.5
A+/IO36
  Top 0.152: U4.1 15.39,57.3 10.82,57.3 7.32,60.81 5.64,60.81 4.42,59.59 J1.5
A-/IO4
  Top 0.152: U2.2 49.07,34.59 48.46,34.59 47.85,35.2 47.85,40.69 52.12,44.96 53.03,44.96 58.98,50.9 58.98,58.22 60.2,59.44 J4.6
A-/IO15
  Top 0.152: U2.6 49.23,37.19 55.63,37.19 56.24,37.8 60.2,37.8 J5.6
A-/IO21  (via drill 0.35)
  Top 0.152: v48.77,49.38 52.88,53.49 54.86,53.49 U3.2 | v51.66,26.52 53.03,26.52 v55.78,23.77
  Bottom 0.152: v48.77,49.38 48.77,45.41 45.11,41.76 45.11,38.56 45.41,38.25 45.41,36.58 44.5,35.66 44.5,33.68 v51.66,26.52 | v55.78,23.77 55.78,20.88 60.2,16.46 J6.6
A-/IO25  (via drill 0.35)
  Top 0.152: v57.61,52.12 57.61,54.25 55.78,56.08 55.02,56.08 U3.6 | v47.85,42.06 47.85,41.6 46.63,40.39 46.63,29.57 46.18,29.11 46.02,29.11 45.87,28.96 45.87,27.13 43.43,24.69 29.41,24.69 24.84,20.12 v24.84,19.66 | v14.94,16.15 14.94,14.48 13.72,13.26 10.06,13.26 7.01,16.31 J3.6
  Bottom 0.152: v57.61,52.12 53.8,48.31 53.8,45.72 53.03,44.96 52.12,44.96 49.23,42.06 v47.85,42.06 | v24.84,19.66 18.44,19.66 v14.94,16.15
A-/IO35
  Top 0.152: U4.6 15.39,53.95 14.78,53.95 8.38,47.55 8.38,39.32 7.01,37.95 J2.6
A-/IO36
  Top 0.152: U4.2 15.39,56.69 9.75,56.69 7.01,59.44 J1.6
A/IO4  (via drill 0.35)
  Top 0.152: v44.5,40.84 46.02,39.32 46.02,34.9 45.11,33.98 43.59,33.98 U2.20 | v45.72,57.91 44.04,57.91 U1.26
  Bottom 0.152: v44.5,40.84 44.5,44.2 48.16,47.85 48.16,54.86 48.46,55.17 48.46,57.15 47.7,57.91 v45.72,57.91
A/IO15
  Top 0.152: U2.16 43.43,36.58 42.67,36.58 41.91,37.34 41.91,37.64 41,38.56 40.23,38.56 39.47,39.32 39.47,53.65 39.78,53.95 39.78,55.63 U1.23
A/IO21
  Top 0.152: U3.20 49.23,53.03 50.9,53.03 51.21,53.34 51.21,62.94 47.4,66.75 44.04,66.75 U1.33
A/IO25  (via drill 0.35)
  Top 0.152: v47.55,55.63 49.07,55.63 U3.16 | v28.5,60.81 27.58,61.72 26.98,61.72 U1.10
  Bottom 0.152: v47.55,55.63 44.04,55.63 43.13,56.54 30.63,56.54 28.35,58.83 28.35,60.66 v28.5,60.81
A/IO35
  Top 0.152: U4.16 21.34,54.71 22.1,54.71 25.6,58.22 25.6,64.77 26.36,65.53 26.82,65.53 U1.7
A/IO36
  Top 0.152: U4.20 21.34,57.3 21.34,64.31 26.36,69.34 26.82,69.34 U1.4
B+/IO5  (via drill 0.35)
  Top 0.152: v53.34,41.45 49.53,41.45 48.16,40.08 48.16,35.51 48.31,35.36 49.07,35.36 U2.3
  Bottom 0.152: v53.34,41.45 53.34,41.91 59.13,47.7 59.13,49.07 64.01,53.95 64.01,60.81 62.79,62.03 J4.7
B+/IO9
  Top 0.152: U4.7 15.39,53.19 14.63,53.19 8.69,47.24 8.69,37.95 7.32,36.58 5.49,36.58 4.42,35.51 J2.7
B+/IO18
  Top 0.152: U2.7 49.23,37.95 55.93,37.95 56.08,38.1 58.67,38.1 59.74,39.17 61.42,39.17 62.64,40.39 J5.7
B+/IO22
  Top 0.152: U3.3 54.86,54.41 53.8,54.41 52.27,55.93 52.27,57.76 57.76,63.25 63.4,63.25 65.38,61.27 65.38,52.27 64.16,51.05 64.16,46.94 65.23,45.87 65.23,44.35 65.53,44.04 65.53,31.09 61.57,27.13 61.57,19.96 62.64,18.9 J6.7
B+/IO26  (via drill 0.35)
  Top 0.152: v56.08,60.66 56.08,57.3 55.78,57 55.02,57 U3.7 | v56.08,62.79 56.08,71.32 53.49,73.91 14.48,73.91 5.64,65.08 5.64,64.16 4.72,63.25 3.81,63.25 2.74,62.18 2.74,15.39 4.27,13.87 J3.7
  Bottom 0.152: v56.08,62.79 v56.08,60.66
B+/IO39
  Top 0.152: U4.3 15.39,55.93 9.75,55.93 7.47,58.22 5.64,58.22 4.42,57 J1.7
B-/IO5
  Top 0.152: U2.4 49.23,35.81 54.25,35.81 56.39,33.68 59.28,33.68 59.74,34.14 63.25,34.14 64.62,35.51 64.62,46.02 63.86,46.79 63.86,51.21 64.62,51.97 64.62,59.44 63.25,60.81 61.57,60.81 60.35,62.03 J4.8
B-/IO9
  Top 0.152: U4.8 15.39,52.58 14.63,52.58 8.99,46.94 8.99,37.49 7.01,35.51 J2.8
B-/IO18
  Top 0.152: U2.8 49.23,38.56 58.37,38.56 60.2,40.39 J5.8
B-/IO22  (via drill 0.35)
  Top 0.152: v56.39,53.03 56.39,54.1 55.63,54.86 55.02,54.86 U3.4 | v60.81,51.66 60.81,47.7 61.57,46.94 61.57,46.02 v62.94,44.65
  Bottom 0.152: v56.39,53.03 57.61,53.03 58.22,53.65 58.83,53.65 v60.81,51.66 | v62.94,44.65 64.31,43.28 64.31,31.39 61.42,28.5 61.42,19.96 60.35,18.9 J6.8
B-/IO26  (via drill 0.35)
  Top 0.152: v52.88,57.45 54.86,57.45 U3.8
  Bottom 0.152: v52.88,57.45 49.07,57.45 42.37,64.16 35.97,64.16 26.98,73.15 11.12,73.15 2.74,64.77 2.74,18.75 3.96,17.53 4.88,17.53 5.64,16.76 5.64,15.09 6.86,13.87 J3.8
B-/IO39
  Top 0.152: U4.4 15.39,55.32 8.53,55.32 7.01,56.84 J1.8
B/IO5  (via drill 0.35)
  Top 0.152: v45.11,35.36 43.59,35.36 U2.18 | v51.82,42.06 53.03,42.06 v59.74,48.77 | v46.48,65.23 46.48,63.7 44.65,61.87 44.04,61.87 U1.29
  Bottom 0.152: v51.82,42.06 v45.11,35.36 | v59.74,48.77 59.74,49.23 64.31,53.8 64.31,62.33 63.25,63.4 48.31,63.4 v46.48,65.23
B/IO9
  Top 0.152: U4.14 21.34,53.19 24.69,53.19 25.3,52.58 29.72,52.58 32.16,55.02 32.16,55.63 U1.17
B/IO18  (via drill 0.35)
  Top 0.152: v43.43,40.84 43.28,40.84 42.37,39.93 42.37,38.25 42.67,37.95 43.43,37.95 U2.14 | v42.37,62.33 42.67,62.33 43.28,62.94 43.89,62.94 U1.30
  Bottom 0.152: v43.43,40.84 43.43,50.6 48.16,55.32 48.16,57 47.7,57.45 46.18,57.45 46.02,57.3 45.41,57.3 42.37,60.35 v42.37,62.33
B/IO22
  Top 0.152: U3.18 49.07,54.25 44.35,54.25 43.74,53.65 43.13,53.65 42.52,54.25 42.52,59.59 41,61.11 41,69.04 42.52,70.56 43.89,70.56 U1.36
B/IO26  (via drill 0.35)
  Top 0.152: v47.4,56.84 49.07,56.84 U3.14 | v28.96,59.13 27.58,60.5 26.98,60.5 U1.11
  Bottom 0.152: v47.4,56.84 31.24,56.84 v28.96,59.13
B/IO39
  Top 0.152: U4.18 21.34,55.93 22.25,55.93 24.69,58.37 24.69,67.21 25.6,68.12 26.82,68.12 U1.5
D+
  Top 0.152: J8.7 45.87,7.47 45.57,7.47 J8.6 45.41,7.47 45.41,19.81 44.35,20.88 43.74,20.88 IC1.4
D-  (via drill 0.35)
  Top 0.152: J8.8 46.48,7.32 46.48,6.86 46.33,6.71 45.11,6.71 44.96,6.86 44.96,7.32 J8.5 44.96,7.47 44.96,7.92 44.81,8.08 v44.81,17.37 | v44.81,21.34 43.74,21.34 IC1.5
  Bottom 0.152: v44.81,17.37 v44.81,21.34
DTR
  Top 0.152: IC1.28 42.67,18.44 42.67,16.61 41.76,15.7 41.76,9.3 36.58,4.12 36.58,3.2 35.81,2.44 28.35,2.44 25.15,5.64 23.47,5.64 19.05,10.06 19.05,27.43 23.32,31.7 24.69,31.7 25.6,30.79 T2.2 25.76,30.63 35.05,30.63 39.32,26.36 40.54,26.36 R_DTR.2
EN_ESP32  (via drill 0.35)
  Top 0.152: C_EN1.1 19.66,36.42 24.69,36.42 24.84,36.58 R_PULL_UP1.1 24.99,36.73 24.99,37.95 v25.3,38.25 | S2.3 15.24,71.32 19.05,71.32 S2.2 19.2,71.17 19.66,70.71 19.96,70.71 | 19.96,70.71 26.82,70.71 U1.3 | 19.96,70.71 v19.96,67.21
  Bottom 0.152: v25.3,38.25 27.74,38.25 30.33,40.84 41.3,40.84 41.6,41.15 41.6,41.76 40.23,43.13 28.35,43.13 19.2,52.27 19.2,66.45 v19.96,67.21
ESP32_RX  (via drill 0.35)
  Top 0.152: v39.62,17.07 40.39,17.07 41.3,17.98 41.3,18.44 IC1.25 | v44.35,52.88 47.85,52.88 48.31,52.43 50.75,52.43 51.51,53.19 51.51,63.09 46.48,68.12 44.04,68.12 U1.34
  Bottom 0.152: v39.62,17.07 30.79,25.91 26.06,25.91 25.76,26.21 25.76,26.82 39.47,40.54 41.45,40.54 42.52,41.6 42.52,51.05 v44.35,52.88
ESP32_TX  (via drill 0.35)
  Top 0.152: v31.55,6.25 23.77,6.25 20.27,9.75 20.27,11.12 21.49,12.34 21.49,13.72 R_CP2101.2 | v48.77,69.8 44.35,69.8 44.04,69.49 U1.35
  Bottom 0.152: v31.55,6.25 40.39,6.25 44.96,1.68 52.43,1.68 61.57,10.82 61.57,11.73 62.33,12.5 63.25,12.5 65.23,14.48 65.23,66.14 61.57,69.8 v48.77,69.8
EXT_5V  (via drill 0.35)
  Top 0.152: RLED5V5.1 24.23,15.7 24.23,19.96 30.33,26.06 32.61,26.06 33.53,26.98 C_CP2102_3.1 33.68,26.98 v35.2,26.98 | v43.59,23.32 42.82,23.32 IC1.8 | v41.15,15.54 40.08,14.48 C_CP2102_4.1 | v50.44,10.82 51.36,10.82 CR3.2 | v53.19,14.48 53.95,14.48 CR1.1
  Bottom 0.152: v41.15,15.54 43.43,17.83 | 43.43,17.83 43.59,17.98 v43.59,23.32 39.93,26.98 v35.2,26.98 | 43.43,17.83 49.99,11.28 | 49.99,11.28 v50.44,10.82 | 49.99,11.28 v53.19,14.48
GND  (via drill 0.35)
  Top 0.152: IC1.29 41.3,20.88 41.6,20.57 43.59,20.57 IC1.3 43.74,20.42 44.2,20.42 44.5,20.12 44.5,17.98 42.06,15.54 42.06,7.77 41.45,7.16 J8.S3 41.3,7.01 41.3,3.35 J8.S5 41.45,3.35 44.2,3.35 J8.S1 44.35,3.35 47.09,3.35 J8.S2 47.24,3.2 49.99,3.2 J8.S6 | 50.29,53.95 49.99,53.65 49.23,53.65 U3.19 | 50.29,53.95 50.29,55.78 49.99,56.08 | 49.99,56.08 49.23,56.08 U3.15 | 49.99,56.08 50.29,56.39 50.29,58.37 49.99,58.67 49.23,58.67 U3.11 | v50.6,53.65 50.29,53.95 | 49.84,25.15 52.58,25.15 U$6.2 | 49.84,25.15 48.46,25.15 46.48,23.16 R1.1 | 49.84,25.15 49.84,22.71 48.92,21.79 48.92,20.73 R3.1 | J4.3 62.79,56.84 62.79,56.24 64.01,55.02 64.01,51.82 63.55,51.36 63.55,44.04 64.01,43.59 64.01,36.73 62.79,35.51 J5.3 | C_CP2102_1.2 23.47,23.16 21.03,23.16 C_CP2102_2.2 20.88,23.01 20.88,14.94 19.96,14.02 19.96,10.52 | 36.27,7.32 36.27,3.35 35.66,2.74 34.75,2.74 33.68,3.81 LED_5V6.1 33.07,3.81 30.94,5.94 23.62,5.94 19.96,9.6 19.96,10.52 | C_CP2102_4.2 36.27,7.32 | 36.27,7.32 30.94,12.65 28.35,12.65 C3.2 | R_GPIO2.2 36.73,23.62 33.68,23.62 C_CP2102_3.2 33.53,23.77 v32,23.77 | v19.66,10.52 19.96,10.52 | S1.5 52.73,69.04 54.1,69.04 54.25,68.89 55.32,68.89 55.47,69.04 55.47,70.56 54.86,71.17 S1.2 54.71,71.32 50.75,71.32 S1.3 50.6,71.32 48.77,73.15 44.04,73.15 U1.38 43.89,73.15 41.76,73.15 36.27,67.67 U1.39_3 | U1.39_7 32.61,63.86 33.38,63.86 U1.39_20 | U1.39_7 32.61,64.01 32.61,64.77 U1.39_17 32.61,64.92 32.61,65.68 | U1.39_7 32.46,63.86 29.72,61.11 U1.15 29.72,54.1 28.5,52.88 25.45,52.88 24.38,53.95 21.34,53.95 U4.15 21.18,53.95 19.51,53.95 | U1.39_9 36.12,63.86 35.36,63.86 U1.39_21 35.2,63.86 34.44,63.86 U1.39_8 34.44,64.01 34.44,64.77 U1.39_18 34.44,64.92 34.44,65.68
  Top 0.152: U1.39_19 36.27,64.92 36.27,65.68 U1.39_6 36.27,65.84 36.27,66.6 U1.39_14 36.27,66.75 36.27,67.51 U1.39_3 | 34.44,65.68 35.2,65.68 U1.39_16 | 32.61,65.68 33.38,65.68 U1.39_15 | U1.39_1 32.61,67.67 33.38,67.67 U1.39_10 33.53,67.51 34.29,67.51 U1.39_2 | U1.39_2 34.44,67.67 35.2,67.67 U1.39_11 35.36,67.67 36.12,67.67 U1.39_3 | U1.1 26.98,73.15 27.58,73.15 32.46,68.28 32.46,67.67 U1.39_1 | U1.39_1 32.61,67.51 32.61,66.75 U1.39_12 32.61,66.6 32.61,65.84 U1.39_4 32.61,65.68 | U1.39_2 34.44,67.51 34.44,66.75 U1.39_13 34.44,66.6 34.44,65.84 U1.39_5 34.44,65.68 | 37.34,40.08 35.51,40.08 C_REG5V6.2 | 37.34,40.08 37.49,39.93 C_REG5V8.2 | 44.96,37.19 43.59,37.19 U2.15 | 44.96,37.19 45.41,37.64 45.41,38.56 44.35,39.62 43.59,39.62 U2.11 | 42.22,34.14 41,32.92 C_3V3_4.2 | 42.22,34.14 42.52,34.44 43.43,34.44 U2.19 43.59,34.59 45.26,34.59 45.72,35.05 45.72,35.66 44.96,36.42 44.96,37.19 | 42.22,34.14 41,35.36 41,36.58 C_3V3_3.2 40.84,36.58 37.64,39.78 C_REG5V8.2 | 28.65,49.07 27.43,49.07 REG5V7.1 27.28,49.23 23.47,49.23 21.34,51.36 U4.11 21.18,51.51 20.42,51.51 | 28.65,49.07 36.12,49.07 IC2.1 36.27,49.07 37.34,48.01 37.34,40.08 | 28.65,49.07 28.65,44.04 28.35,43.74 26.82,43.74 22.71,39.62 19.66,39.62 C_EN1.2 | 37.34,40.08 C_REG5V8.2 | 20.42,51.51 19.2,52.73 19.2,53.65 19.51,53.95 | 20.42,56.54 21.18,56.54 U4.19 | 20.42,56.54 19.2,55.32 19.2,54.25 19.51,53.95 | 20.42,56.54 19.2,57.76 19.2,69.65 S2.1 19.05,69.65 17.68,69.65 17.22,69.19 S2.5 17.07,69.19 16.61,69.65 15.24,69.65 S2.4 15.09,69.65 8.84,63.4 6.55,63.4 5.33,62.18 4.42,62.18 J1.3 | 20.42,51.51 13.26,44.35 U$1.2
  Bottom 0.152: J8.S6 50.14,3.35 50.14,7.01 J8.S4 50.14,7.16 55.47,12.5 | 55.47,12.5 60.66,12.5 61.87,13.72 62.64,13.72 J6.3 | U$4.2 52.58,46.33 50.6,48.31 v50.6,53.65 52.58,55.63 60.66,55.63 61.87,56.84 62.64,56.84 J4.3 | J5.3 62.64,35.36 62.64,34.44 61.42,33.22 61.42,32.31 54.41,25.3 52.73,25.3 U$6.2 52.58,25.15 51.36,23.93 51.36,22.25 55.47,18.14 55.47,12.5 | 19.66,23.77 v32,23.77 | 19.66,23.77 13.26,30.18 U$2.2 13.11,30.33 13.11,31.24 10.67,33.68 10.67,41.76 | U$3.2 13.26,16.92 v19.66,10.52 22.1,8.08 22.1,3.81 JP1.3 22.25,3.81 24.08,1.98 25.15,1.98 26.36,3.2 41.3,3.2 J8.S5 | J3.3 4.42,18.75 5.33,18.75 6.55,17.53 12.65,17.53 13.11,17.07 U$3.2 | 19.66,23.77 19.66,23.47 13.26,17.07 U$3.2 | 10.67,41.76 6.4,41.76 5.18,40.54 4.42,40.54 J2.3 | 10.67,41.76 13.11,44.2 U$1.2
  pour Top: -1.27,76.2 68.58,76.2 68.58,-0.64 -0.64,-0.64 -0.64,75.56
  pour Bottom: -1.27,76.2 68.58,76.2 68.58,-0.64 -0.64,-0.64 -0.64,75.56
GND1
  Top 0.152: J8.9 46.94,7.47 46.94,19.51 46.48,19.96 R1.2
GND3
  Top 0.152: J8.3 44.04,7.32 44.04,6.86 46.02,4.88 49.68,4.88 52.27,7.47 52.27,11.43 52.43,11.58 52.43,15.24 48.01,19.66 48.01,22.86 48.77,23.62 R3.2
GPIO2
  Top 0.152: U1.24 41.15,54.71 46.33,49.53 46.33,34.29 44.96,32.92 44.96,29.41 45.11,29.26 45.26,29.26 45.57,28.96 45.57,27.28 43.59,25.3 39.62,25.3 38.1,26.82 36.88,26.82 R_GPIO2.1
IO0  (via drill 0.35)
  Top 0.152: T2.3 24.84,32.92 24.84,34.59 25.91,35.66 25.91,38.86 R_PULL_UP3.1 24.99,39.93 v31.85,46.79 | S1.1 54.71,69.8 50.75,69.8 S1.4 50.6,69.65 v49.23,68.28 | v47.09,66.14 47.09,58.37 45.57,56.84 44.04,56.84 U1.25 43.89,56.69 43.13,55.93 v43.13,55.63 | v37.95,52.88 39.01,53.95 v39.01,54.1
  Bottom 0.152: v49.23,68.28 v47.09,66.14 | v37.95,52.88 v31.85,46.79 | v39.01,54.1 41.6,54.1 v43.13,55.63
IO16-SDA  (via drill 0.35)
  Top 0.152: v41.6,67.82 41.3,67.51 41.3,61.27 43.28,59.28 43.89,59.28 U1.27
  Bottom 0.152: v41.6,67.82 35.97,67.82 30.02,73.76 10.82,73.76 2.13,65.08 2.13,11.73 11.89,1.98 17.83,1.98 19.66,3.81 JP1.2
IO17-SCL  (via drill 0.35)
  Top 0.152: v41.91,64.77 41.76,64.62 41.76,62.03 43.13,60.66 43.89,60.66 U1.28
  Bottom 0.152: v41.91,64.77 37.19,64.77 28.5,73.46 10.97,73.46 2.44,64.92 2.44,14.02 3.96,12.5 8.38,12.5 17.07,3.81 JP1.1
N$3  (via drill 0.35)
  Top 0.152: J8.2 43.37,8.45 v43.81,8.89 | J8.11 48.07,8.7 v48.26,8.89 v47.62,9.53 | v46.02,13.97 46.02,16.2 v46.33,16.51 | CR1.2 54.59,12.68 54.74,12.68 54.83,12.76 54.83,13.91 54.76,13.97 v54.76,14.61
  Bottom 0.152: v43.81,8.89 v48.26,8.89 | v47.62,9.53 48.9,10.79 48.9,11.43 46.99,13.34 46.35,13.34 46.02,13.67 v46.02,13.97 | v46.33,16.51 53.98,16.51 54.76,15.72 v54.76,14.61
N$4  (via drill 0.35)
  Top 0.152: CR3.1 51.36,13.41 48.92,13.41 CR2.1 48.77,13.41 47.4,14.78 v47.4,21.49 | v41.3,27.58 40.69,27.58 39.32,28.96 39.32,37.03 38.41,37.95 35.81,37.95 34.14,39.62 34.14,40.84 36.12,42.82 36.12,44.5 IC2.3
  Bottom 0.152: v47.4,21.49 v41.3,27.58
N$8
  Top 0.152: IC1.26 41.76,18.44 41.76,17.98 39.01,15.24 25.76,15.24 23.77,13.26 23.01,13.26 22.86,13.11 22.86,11.73 21.64,10.52 R_CP2101.1
N$9
  Top 0.152: T1.1 44.65,28.19 42.06,28.19 40.69,29.57 R_DTR.1
N$10
  Top 0.152: T2.1 23.93,30.63 27.43,27.13 30.48,27.13 R_RTS.1
N$19
  Top 0.152: LED_5V6.2 34.9,3.81 27.28,11.43 24.99,11.43 24.23,12.19 RLED5V5.2
RTS
  Top 0.152: 34.75,19.36 30.48,23.62 R_RTS.2 | 34.75,19.36 36.42,17.68 40.39,17.68 40.69,17.98 40.69,18.44 IC1.24 | 34.75,19.36 39.62,24.23 43.43,24.23 46.63,27.43 46.63,28.04 T1.2
Z+/IO10  (via drill 0.35)
  Top 0.152: U1.18 33.53,53.49 37.95,49.07 v37.95,42.22
  Bottom 0.152: v37.95,42.22 22.55,42.22 13.26,32.92 U$2.1
Z+/IO13
  Top 0.152: U1.16 31.09,55.78 31.09,56.39 31.7,57 41.76,57 42.22,56.54 42.22,54.1 47.55,48.77 52.58,48.77 U$4.1
Z+/IO19  (via drill 0.35)
  Top 0.152: v46.18,66.14 46.18,65.99 44.65,64.47 44.04,64.47 U1.31
  Bottom 0.152: v46.18,66.14 48.92,68.89 60.2,68.89 64.62,64.47 64.62,52.88 60.35,48.62 60.35,43.13 J5.10
Z+/IO23  (via drill 0.35)
  Top 0.152: v49.38,50.9 49.68,50.9 51.82,53.03 51.82,63.25 48.62,66.45 48.62,68.58 49.38,69.34 49.38,70.1 47.55,71.93 44.04,71.93 U1.37 | v49.38,43.13 49.38,42.67 47.55,40.84 47.55,32.92 52.58,27.89 U$6.1
  Bottom 0.152: v49.38,43.13 v49.38,50.9
Z+/IO27  (via drill 0.35)
  Top 0.152: v28.19,53.49 28.19,58.52 27.58,59.13 26.98,59.13 U1.12 | v26.67,45.72 23.32,45.72 14.48,36.88 14.48,20.88 13.26,19.66 U$3.1
  Bottom 0.152: v28.19,53.49 28.19,47.24 v26.67,45.72
Z+/IO34  (via drill 0.35)
  Top 0.152: v25.3,66.9 26.82,66.9 U1.6
  Bottom 0.152: v25.3,66.9 25.3,71.63 24.99,71.93 23.77,71.93 13.26,61.42 13.26,46.94 U$1.1

### Text on the board
tPlace: BOOT | RESET | SCL | SDA | GND | +12V | Version 2